# Altium schematic sheet mftpsch.SchDoc
size A
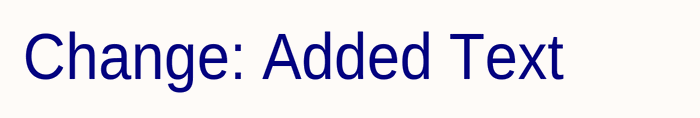
[diagram p0: mftpsch.SchDoc]

## Notes on the sheet
- Change: Added Text